# Altium schematic sheet Insole_MCU.SchDoc
size 420 x 297 mm; SheetNumber: 1; SheetTotal: 1
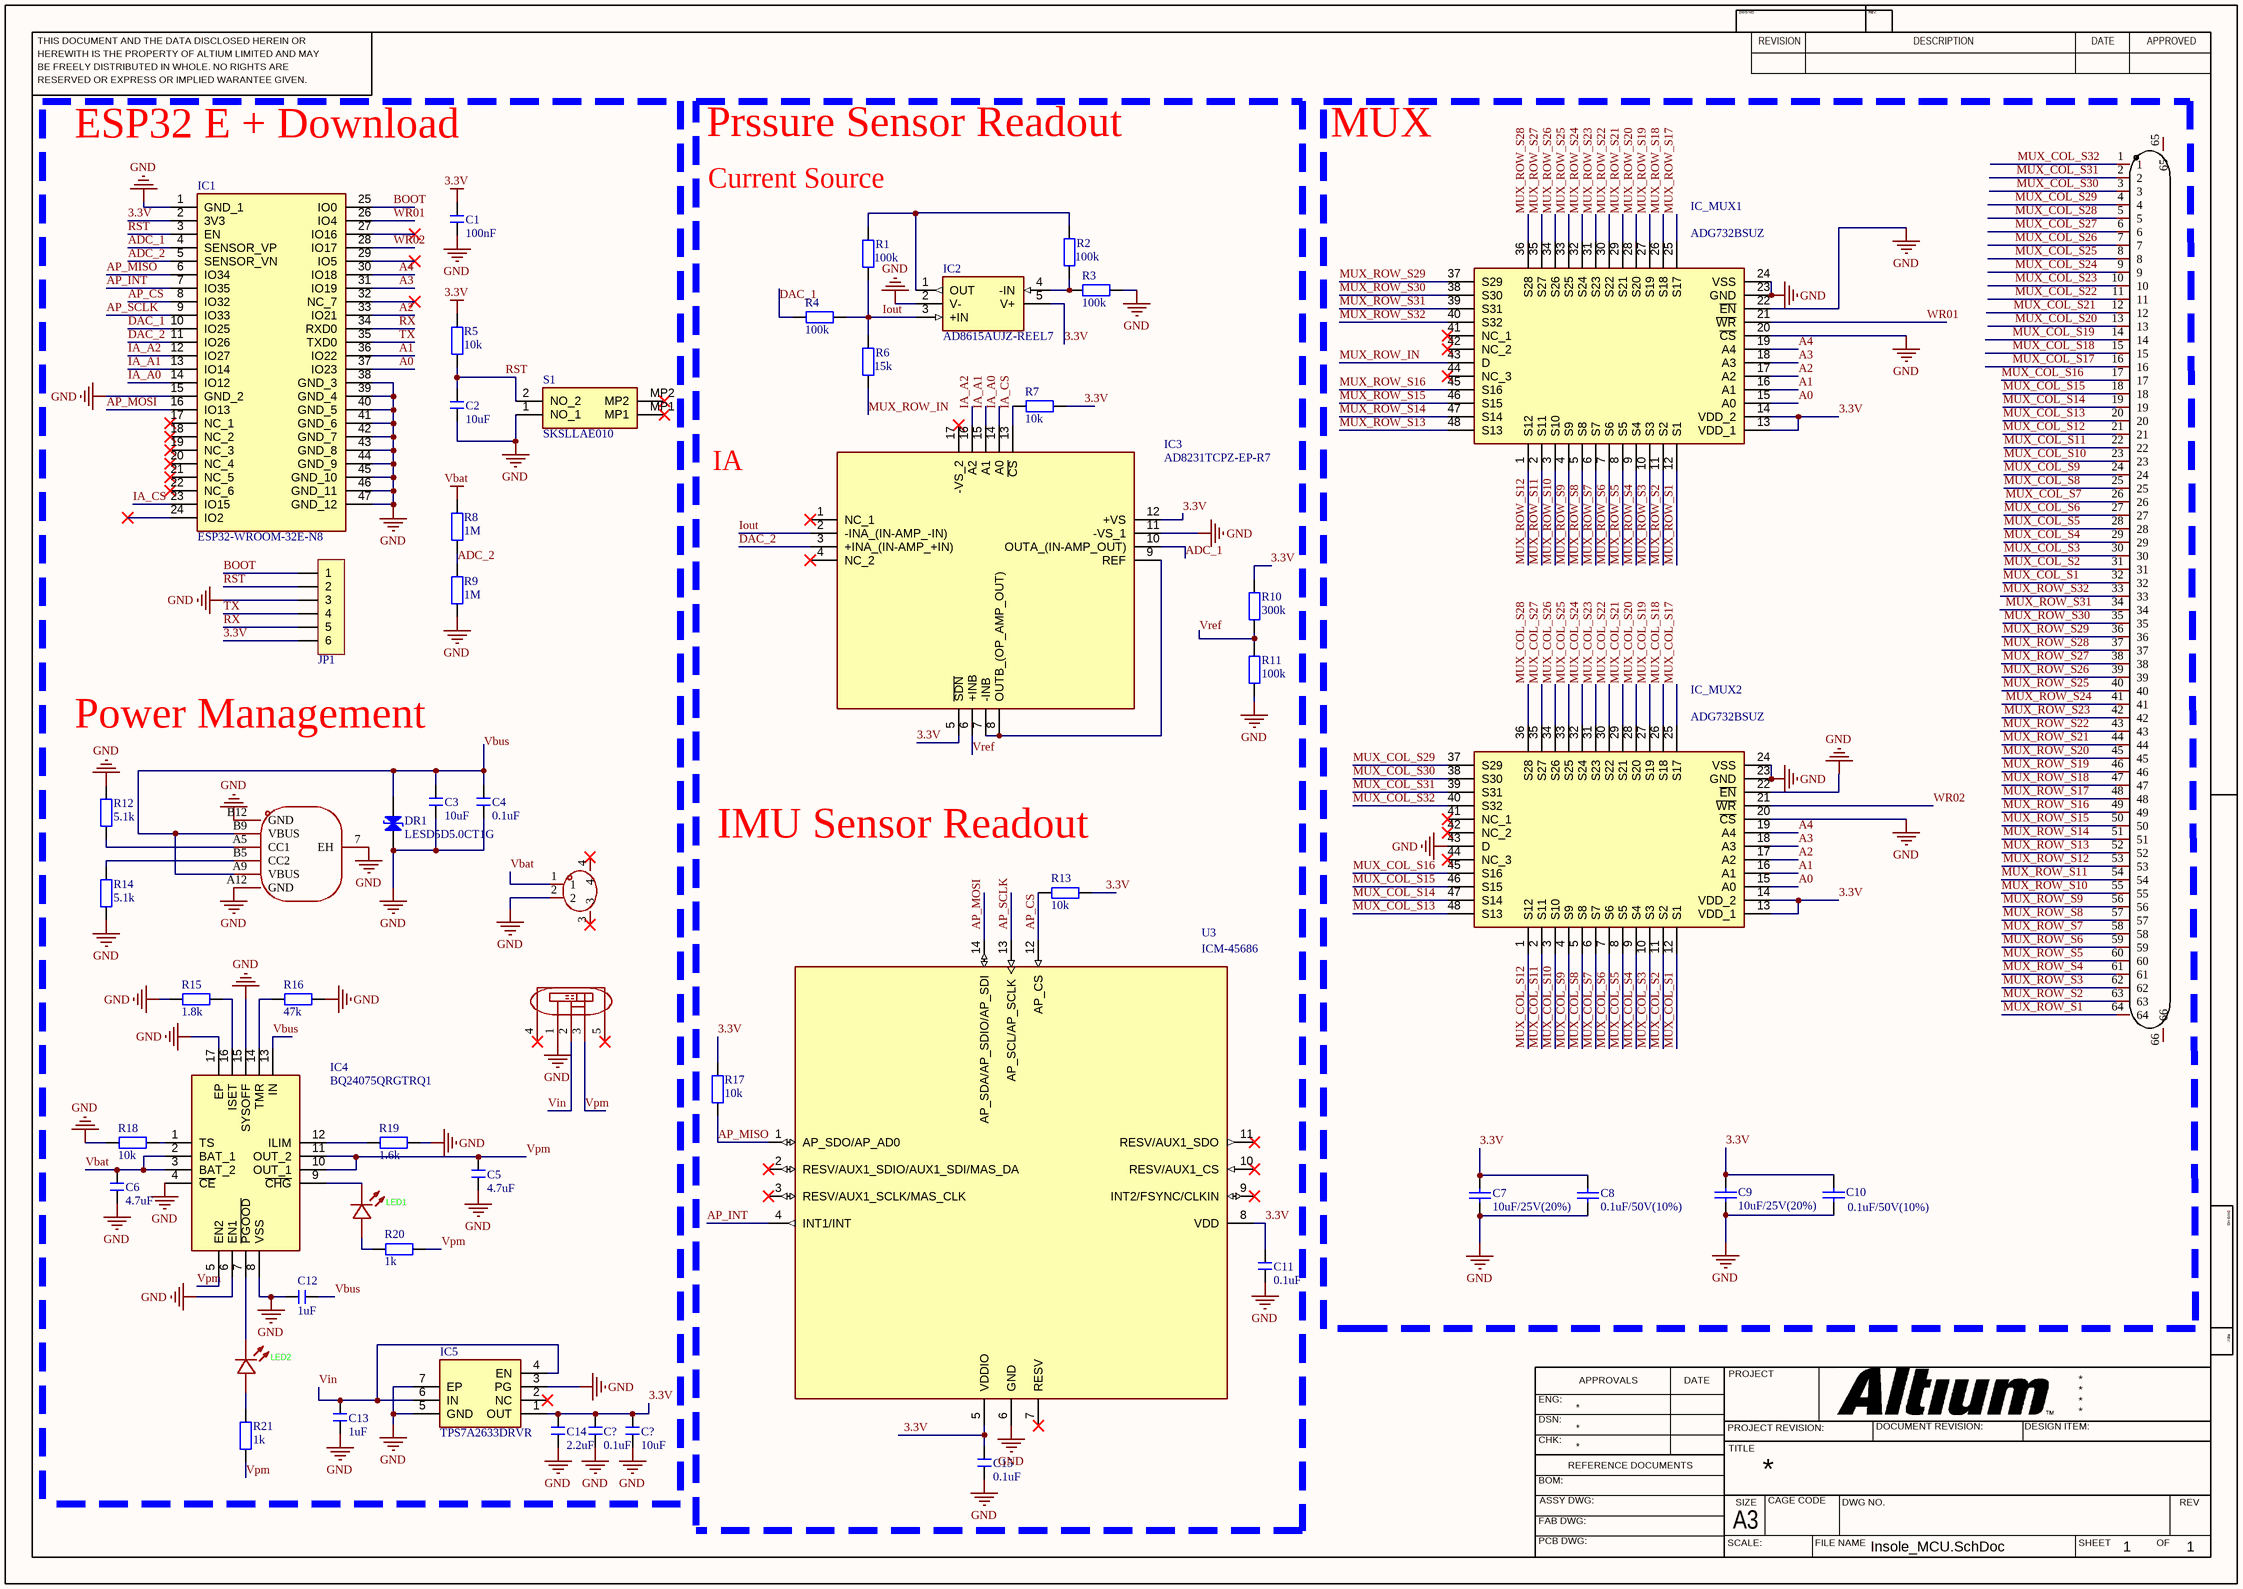
[diagram p0: Insole_MCU.SchDoc]

## Parts
(Parts that share a designator on the sheet are numbered #1, #2 ... from top to bottom, then left to right.)
C1  100nF  [C0402_L]
C2  10uF  [C0402_L]
C3  10uF  [C0402_L]
C4  0.1uF  [C0402_L]
C5  4.7uF  [C0402_L]
C6  4.7uF  [C0402_L]
C7  10uF/25V(20%)  [C0402_L]
C8  0.1uF/50V(10%)  [C0402_L]
C9  10uF/25V(20%)  [C0402_L]
C10  0.1uF/50V(10%)  [C0402_L]
C11  0.1uF  [C0402_L]
C12  1uF  [C0402_L]
C13  1uF  [C0402_L]
C14  2.2uF  [C0402_L]
C15  0.1uF  [C0402_L]
C?#1  0.1uF  [C0402_L]
C?#2  10uF  [C0402_L]
DR1  LESD5D5.0CT1G  [SOD-523]
FPC1  8.15A0.064200  [PCBComponent_1]  (value not drawn)
IC1  ESP32-WROOM-32E-N8  [ESP32WROOM32EN8]
IC2  AD8615AUJZ-REEL7  [SOT95P280X100-5N]
IC3  AD8231TCPZ-EP-R7  [QFN65P400X400X80-17N-D]
IC4  BQ24075QRGTRQ1  [QFN50P300X300X100-17N-D]
IC5  TPS7A2633DRVR  [TPS7A2633DRVR]
IC_MUX1  ADG732BSUZ  [QFP50P900X900X120-48N]
IC_MUX2  ADG732BSUZ  [QFP50P900X900X120-48N]
JP1  HDR-1X6  [HDR2.0-M-LI-6P]  (value not drawn)
LED1  NCD0402R1  [PCBComponent_1]  (value not drawn)
LED2  NCD0402W1  [PCBComponent_1]  (value not drawn)
R1  100k  [R0402_L]
R2  100k  [R0402_L]
R3  100k  [R0402_L]
R4  100k  [R0402_L]
R5  10k  [R0402_L]
R6  15k  [R0402_L]
R7  10k  [R0402_L]
R8  1M  [R0402_L]
R9  1M  [R0402_L]
R10  300k  [R0603_L]
R11  100k  [R0603_L]
R12  5.1k  [R0402_L]
R13  10k  [R0402_L]
R14  5.1k  [R0402_L]
R15  1.8k  [R0402_L]
R16  47k  [R0402_L]
R17  10k  [R0402_L]
R18  10k  [R0402_L]
R19  1.6k  [R0402_L]
R20  1k  [R0402_L]
R21  1k  [R0402_L]
S1  SKSLLAE010  [SKSLLAE010]
SW1  SSSF111800  [SSSF111800]  (value not drawn)
U1  ZX-PH2.0-WT2P  [PCBComponent_1]  (value not drawn)
U2  TYPEC-250Y-BRP6L68  [PCBComponent_1]  (value not drawn)
U3  ICM-45686  [IC_ICM-45686]

## Blocks framed on the sheet
MUX: C7-C10 FPC1 IC_MUX1 IC_MUX2

## Nets
3.3V: C1.1 C7.2 C8.2 C9.2 C10.2 C11.1 C14.1 C15.1 C?#1.1 C?#2.1 IC1.2(3V3) IC2.5(V+) IC3.5(~{SDN}) IC3.12(+VS) IC5.1(OUT) IC_MUX1.13(VDD_1) IC_MUX1.14(VDD_2) IC_MUX2.13(VDD_1) IC_MUX2.14(VDD_2) JP1.6 R5.1 R7.1 R10.1 R13.1 R17.1 U3.5(VDDIO) U3.8(VDD)
GND: C1.2 C2.2 C3.2 C4.2 C5.2 C6.2 C7.1 C8.1 C9.1 C10.1 C11.2 C12.2 C13.2 C14.2 C15.2 C?#1.2 C?#2.2 DR1.2(K) IC1.1(GND_1) IC1.15(GND_2) IC1.38(GND_3) IC1.39(GND_4) IC1.40(GND_5) IC1.41(GND_6) IC1.42(GND_7) IC1.43(GND_8) IC1.44(GND_9) IC1.45(GND_10) IC1.46(GND_11) IC1.47(GND_12) IC2.2(V-) IC3.11(-VS_1) IC4.4(~{CE}) IC4.6(EN1) IC4.8(VSS) IC4.15(SYSOFF) IC4.17(EP) IC5.3(PG) IC5.5(GND) IC5.7(EP) IC_MUX1.20(~{CS}) IC_MUX1.22(~{EN}) IC_MUX1.23(GND) IC_MUX1.24(VSS) IC_MUX2.20(~{CS}) IC_MUX2.22(~{EN}) IC_MUX2.23(GND) IC_MUX2.24(VSS) IC_MUX2.43(D) JP1.3 R3.1 R9.2 R11.2 R12.2 R14.1 R15.1 R16.1 R18.2 R19.2 S1.1(NO_1) SW1.1 U1.2 U2.7(EH) U2.A12(GND) U2.B12(GND) U3.6(GND)
Vbat: C6.1 IC4.2(BAT_1) IC4.3(BAT_2) R8.1 U1.1
A0: IC1.37(IO23) IC_MUX1.15(A0) IC_MUX2.15(A0)
A1: IC1.36(IO22) IC_MUX1.16(A1) IC_MUX2.16(A1)
A2: IC1.33(IO21) IC_MUX1.17(A2) IC_MUX2.17(A2)
A3: IC1.31(IO19) IC_MUX1.18(A3) IC_MUX2.18(A3)
A4: IC1.30(IO18) IC_MUX1.19(A4) IC_MUX2.19(A4)
ADC_1: IC1.4(SENSOR_VP) IC3.10(OUTA_(IN-AMP_OUT))
ADC_2: IC1.5(SENSOR_VN) R8.2 R9.1
AP_CS: IC1.8(IO32) R13.2 U3.12(AP_CS)
AP_INT: IC1.7(IO35) U3.4(INT1/INT)
AP_MISO: IC1.6(IO34) R17.2 U3.1(AP_SDO/AP_AD0)
AP_MOSI: IC1.16(IO13) U3.14(AP_SDA/AP_SDIO/AP_SDI)
AP_SCLK: IC1.9(IO33) U3.13(AP_SCL/AP_SCLK)
BOOT: IC1.25(IO0) JP1.1
DAC_1: IC1.10(IO25) R4.2
DAC_2: IC1.11(IO26) IC3.3(+INA_(IN-AMP_+IN))
IA_A0: IC1.14(IO12) IC3.14(A0)
IA_A1: IC1.13(IO14) IC3.15(A1)
IA_A2: IC1.12(IO27) IC3.16(A2)
IA_CS: IC1.23(IO15) IC3.13(~{CS}) R7.2
Iout: IC2.3(+IN) IC3.2(-INA_(IN-AMP_-IN)) R1.1 R4.1 R6.2
MUX_COL_S1: FPC1.32 IC_MUX2.12(S1)
MUX_COL_S2: FPC1.31 IC_MUX2.11(S2)
MUX_COL_S3: FPC1.30 IC_MUX2.10(S3)
MUX_COL_S4: FPC1.29 IC_MUX2.9(S4)
MUX_COL_S5: FPC1.28 IC_MUX2.8(S5)
MUX_COL_S6: FPC1.27 IC_MUX2.7(S6)
MUX_COL_S7: FPC1.26 IC_MUX2.6(S7)
MUX_COL_S8: FPC1.25 IC_MUX2.5(S8)
MUX_COL_S9: FPC1.24 IC_MUX2.4(S9)
MUX_COL_S10: FPC1.23 IC_MUX2.3(S10)
MUX_COL_S11: FPC1.22 IC_MUX2.2(S11)
MUX_COL_S12: FPC1.21 IC_MUX2.1(S12)
MUX_COL_S13: FPC1.20 IC_MUX2.48(S13)
MUX_COL_S14: FPC1.19 IC_MUX2.47(S14)
MUX_COL_S15: FPC1.18 IC_MUX2.46(S15)
MUX_COL_S16: FPC1.17 IC_MUX2.45(S16)
MUX_COL_S17: FPC1.16 IC_MUX2.25(S17)
MUX_COL_S18: FPC1.15 IC_MUX2.26(S18)
MUX_COL_S19: FPC1.14 IC_MUX2.27(S19)
MUX_COL_S20: FPC1.13 IC_MUX2.28(S20)
MUX_COL_S21: FPC1.12 IC_MUX2.29(S21)
MUX_COL_S22: FPC1.11 IC_MUX2.30(S22)
MUX_COL_S23: FPC1.10 IC_MUX2.31(S23)
MUX_COL_S24: FPC1.9 IC_MUX2.32(S24)
MUX_COL_S25: FPC1.8 IC_MUX2.33(S25)
MUX_COL_S26: FPC1.7 IC_MUX2.34(S26)
MUX_COL_S27: FPC1.6 IC_MUX2.35(S27)
MUX_COL_S28: FPC1.5 IC_MUX2.36(S28)
MUX_COL_S29: FPC1.4 IC_MUX2.37(S29)
MUX_COL_S30: FPC1.3 IC_MUX2.38(S30)
MUX_COL_S31: FPC1.2 IC_MUX2.39(S31)
MUX_COL_S32: FPC1.1 IC_MUX2.40(S32)
MUX_ROW_IN: IC_MUX1.43(D) R6.1
MUX_ROW_S1: FPC1.64 IC_MUX1.12(S1)
MUX_ROW_S2: FPC1.63 IC_MUX1.11(S2)
MUX_ROW_S3: FPC1.62 IC_MUX1.10(S3)
MUX_ROW_S4: FPC1.61 IC_MUX1.9(S4)
MUX_ROW_S5: FPC1.60 IC_MUX1.8(S5)
MUX_ROW_S6: FPC1.59 IC_MUX1.7(S6)
MUX_ROW_S7: FPC1.58 IC_MUX1.6(S7)
MUX_ROW_S8: FPC1.57 IC_MUX1.5(S8)
MUX_ROW_S9: FPC1.56 IC_MUX1.4(S9)
MUX_ROW_S10: FPC1.55 IC_MUX1.3(S10)
MUX_ROW_S11: FPC1.54 IC_MUX1.2(S11)
MUX_ROW_S12: FPC1.53 IC_MUX1.1(S12)
MUX_ROW_S13: FPC1.52 IC_MUX1.48(S13)
MUX_ROW_S14: FPC1.51 IC_MUX1.47(S14)
MUX_ROW_S15: FPC1.50 IC_MUX1.46(S15)
MUX_ROW_S16: FPC1.49 IC_MUX1.45(S16)
MUX_ROW_S17: FPC1.48 IC_MUX1.25(S17)
MUX_ROW_S18: FPC1.47 IC_MUX1.26(S18)
MUX_ROW_S19: FPC1.46 IC_MUX1.27(S19)
MUX_ROW_S20: FPC1.45 IC_MUX1.28(S20)
MUX_ROW_S21: FPC1.44 IC_MUX1.29(S21)
MUX_ROW_S22: FPC1.43 IC_MUX1.30(S22)
MUX_ROW_S23: FPC1.42 IC_MUX1.31(S23)
MUX_ROW_S24: FPC1.41 IC_MUX1.32(S24)
MUX_ROW_S25: FPC1.40 IC_MUX1.33(S25)
MUX_ROW_S26: FPC1.39 IC_MUX1.34(S26)
MUX_ROW_S27: FPC1.38 IC_MUX1.35(S27)
MUX_ROW_S28: FPC1.37 IC_MUX1.36(S28)
MUX_ROW_S29: FPC1.36 IC_MUX1.37(S29)
MUX_ROW_S30: FPC1.35 IC_MUX1.38(S30)
MUX_ROW_S31: FPC1.34 IC_MUX1.39(S31)
MUX_ROW_S32: FPC1.33 IC_MUX1.40(S32)
RST: C2.1 IC1.3(EN) JP1.2 R5.2 S1.2(NO_2)
RX: IC1.34(RXD0) JP1.5
TX: IC1.35(TXD0) JP1.4
Vbus: C3.1 C4.1 C12.1 DR1.1(A) IC4.13(IN) U2.A9(VBUS) U2.B9(VBUS)
Vin: C13.1 IC5.4(EN) IC5.6(IN) SW1.2
Vpm: C5.1 IC4.5(EN2) IC4.10(OUT_1) IC4.11(OUT_2) R20.1 R21.1 SW1.3
Vref: IC3.6(+INB) R10.2 R11.1
WR01: IC1.26(IO4) IC_MUX1.21(~{WR})
WR02: IC1.28(IO17) IC_MUX2.21(~{WR})
NetIC2_1: IC2.1(OUT) R1.2 R2.2
NetIC2_4: IC2.4(-IN) R2.1 R3.2
NetIC3_7: IC3.7(-INB) IC3.8(OUTB_(OP_AMP_OUT)) IC3.9(REF)
NetIC4_1: IC4.1(TS) R18.1
NetIC4_7: IC4.7(~{PGOOD}) LED2.1(K)
NetIC4_9: IC4.9(~{CHG}) LED1.1(K)
NetIC4_12: IC4.12(ILIM) R19.1
NetIC4_14: IC4.14(TMR) R16.2
NetIC4_16: IC4.16(ISET) R15.2
NetLED1_2: LED1.2(A) R20.2
NetLED2_2: LED2.2(A) R21.2
NetR12_1: R12.1 U2.A5(CC1)
NetR14_2: R14.2 U2.B5(CC2)

Not connected (* = marked no-connect by the designer): FPC1 65 66; IC1 17(NC_1)* 18(NC_2)* 19(NC_3)* 20(NC_4)* 21(NC_5)* 22(NC_6)* 24(IO2)* 27(IO16)* 29(IO5)* 32(NC_7)*; IC3 1(NC_1)* 4(NC_2)* 17(-VS_2)*; IC5 2(NC)*; IC_MUX1 41(NC_1)* 42(NC_2)* 44(NC_3)*; IC_MUX2 41(NC_1)* 42(NC_2)* 44(NC_3)*; S1 MP1* MP2*; SW1 4* 5*; U1 3* 4*; U3 2(RESV/AUX1_SDIO/AUX1_SDI/MAS_DA)* 3(RESV/AUX1_SCLK/MAS_CLK)* 7(RESV)* 9(INT2/FSYNC/CLKIN)* 10(RESV/AUX1_CS)* 11(RESV/AUX1_SDO)*

## Notes on the sheet
- ESP32 E + Download
- Prssure Sensor Readout
- (near R1) Current Source
- IA
- Power Management
- (near R13) IMU Sensor Readout
- THIS DOCUMENT AND THE DATA DISCLOSED HEREIN OR
- HEREWITH IS THE PROPERTY OF ALTIUM LIMITED AND MAY
- DWG NO:
- REVISION
- REV:
- DESCRIPTION
- DATE
- APPROVED
- BE FREELY DISTRIBUTED IN WHOLE. NO RIGHTS ARE
- RESERVED OR EXPRESS OR IMPLIED WARANTEE GIVEN.
- ENG:
- APPROVALS
- PROJECT
- DSN:
- CHK:
- REFERENCE DOCUMENTS
- PROJECT REVISION:
- TITLE
- DOCUMENT REVISION:
- DESIGN ITEM:
- BOM:
- FAB DWG:
- PCB DWG:
- ASSY DWG:
- SCALE:
- A3
- SIZE
- CAGE CODE
- FILE NAME
- DWG NO.
- SHEET
- OF
- REV

## Library data of the parts
C1-C6 C11-C15 C?#1 C?#2 = C: 贴片电容; BOM名称: 无极性贴片电容; 淘宝ID: 封装库来自淘宝 ID：黄晶宝石; 联系售后，技术支持: https://shop463601444.taobao.com; 唯一出售店铺网址: https://shop463601444.taobao.com
C7-C10 = C: 贴片电容/MLCC电容; BOM名称: 无极性贴片电容; 联系下单店铺卖家 免费帮你查找封装: 联系下单店铺卖家 免费技术指导; 当前库版本V2024.2.3 @淘宝卖家:黄晶宝石: 最新版本发布https://item.taobao.com/item.htm?id=566775463719
DR1 = DR: 瞬态电压抑制二极管 1负极; 版权归属: 封装库来自淘宝 ID：黄晶宝石; BOM名称: 瞬态电压抑制二极管; 学习资源: https://item.taobao.com/item.htm?id=566775463719
FPC1 = 8.15A0.064200: Manufacturer: DIANWEI(钿威科技); Add into BOM: yes; Locking Feature: Clamshell; Number of Contacts: 64P; Pitch: 0.5mm; Symbol: 8.15A0.064200; Device: 8.15A0.064200; LCSC Part Name: 翻盖式 下接 P数:64P 间距:0.5mm; Supplier Part: C20626047; Manufacturer Part: 8.15A0.064200; Supplier Footprint: SMD,P=0.5mm,卧贴; JLCPCB Part Class: Extended Part; Datasheet: https://atta.szlcsc.com/upload/public/pdf/source/20240226/9B0E964ABAD9EBDCC7FF6472C3CD9B36.pdf; Supplier: LCSC; Convert to PCB: yes; Contact Type: Bottom Contact; Height Above Board: 1.8mm; Contact Plating: Gold
IC1 = ESP32-WROOM-32E-N8: Integrated Circuit; Manufacturer_Name: Espressif Systems; Datasheet Link: https://www.google.com/url?sa=t&rct=j&q=&esrc=s&source=web&cd=&ved=2ahUKEwjLw4ysybv2AhXFzIUKHZUbB64QFnoECCwQAQ&url=https%3A%2F%2Fwww.espressif.com%2Fsites%2Fdefault%2Ffiles%2Fdocumentation%2Fesp32-wroom-32e_esp32-wroom-32ue_datasheet_en.pdf&usg=AOvVaw1xSL; Height: 3.25mm; Manufacturer_Part_Number: ESP32-WROOM-32E-N8; Mouser Part Number: 356-ESP32WRM32E164PH; Mouser Price/Stock: https://www.mouser.co.uk/ProductDetail/Espressif-Systems/ESP32-WROOM-32E-N8?qs=Li%252BoUPsLEnsLnZW%252BGLgUhw%3D%3D
IC2 = AD8615AUJZ-REEL7: Integrated Circuit; Manufacturer_Name: Analog Devices; Datasheet Link: http://www.farnell.com/datasheets/1841629.pdf; Height: 1mm; Manufacturer_Part_Number: AD8615AUJZ-REEL7; Mouser Part Number: 584-AD8615AUJZ-R7; Mouser Price/Stock: https://www.mouser.co.uk/ProductDetail/Analog-Devices/AD8615AUJZ-REEL7?qs=%2FtpEQrCGXCyHRrprFEn%2Fog%3D%3D; Arrow Part Number: AD8615AUJZ-REEL7; Arrow Price/Stock: https://www.arrow.com/en/products/ad8615aujz-reel7/analog-devices?utm_currency=USD&region=europe
IC3 = AD8231TCPZ-EP-R7: Integrated Circuit; Manufacturer_Name: Analog Devices; Datasheet Link: https://www.analog.com/media/en/technical-documentation/data-sheets/AD8231-EP.pdf; Height: 0.8mm; Manufacturer_Part_Number: AD8231TCPZ-EP-R7; Mouser Part Number: 584-AD8231TCPZ-EP-R7; Mouser Price/Stock: https://www.mouser.co.uk/ProductDetail/Analog-Devices/AD8231TCPZ-EP-R7?qs=%2FtpEQrCGXCwVvPTzyZftPQ%3D%3D; Arrow Part Number: AD8231TCPZ-EP-R7; Arrow Price/Stock: https://www.arrow.com/en/products/ad8231tcpz-ep-r7/analog-devices?region=nac
IC4 = BQ24075QRGTRQ1: Integrated Circuit; Manufacturer_Name: Texas Instruments; Datasheet Link: http://www.ti.com/lit/gpn/bq24075-q1; Height: 1mm; Manufacturer_Part_Number: BQ24075QRGTRQ1; Mouser Part Number: 595-BQ24075QRGTRQ1; Mouser Price/Stock: https://www.mouser.co.uk/ProductDetail/Texas-Instruments/BQ24075QRGTRQ1?qs=i8JZjLRTtkLLeOPMlhTMpg%3D%3D; Arrow Part Number: BQ24075QRGTRQ1; Arrow Price/Stock: null?region=nac
IC5 = TPS7A2633DRVR: Integrated Circuit; Manufacturer_Name: Texas Instruments; Datasheet Link: https://www.ti.com/lit/gpn/TPS7A26; Height: 0.8mm; Manufacturer_Part_Number: TPS7A2633DRVR; Mouser Part Number: 595-TPS7A2633DRVR; Mouser Price/Stock: https://www.mouser.co.uk/ProductDetail/Texas-Instruments/TPS7A2633DRVR?qs=OTrKUuiFdkZcobdYhR7qbQ%3D%3D; Arrow Part Number: TPS7A2633DRVR; Arrow Price/Stock: null?utm_currency=USD&region=nac
IC_MUX1 IC_MUX2 = ADG732BSUZ: Integrated Circuit; Manufacturer_Name: Analog Devices; Datasheet Link: https://datasheet.datasheetarchive.com/originals/distributors/Datasheets-4/DSA-69835.pdf; Height: 1.2mm; Manufacturer_Part_Number: ADG732BSUZ; Mouser Part Number: 584-ADG732BSUZ; Mouser Price/Stock: https://www.mouser.co.uk/ProductDetail/Analog-Devices/ADG732BSUZ?qs=BpaRKvA4VqFZhnJK9M1XMA%3D%3D; Arrow Part Number: ADG732BSUZ; Arrow Price/Stock: https://www.arrow.com/en/products/adg732bsuz/analog-devices?region=europe
JP1 = Header 6: 6P接插件; 封装库来自淘宝卖家 ID：黄晶宝石: 最新版本发布https://item.taobao.com/item.htm?id=566775463719
LED1 = NCD0402R1: Manufacturer: 国星光电; Symbol: FC-F1005HRK-620H5; Add into BOM: yes; Emitted Color: Red; Forward Voltage (VF): 1.6V~2.6V; Power Dissipation: 65mW; Forward Current: 5mA; Dominant Wavelength: 615nm~635nm; Lens Color: 无色透明透镜; Luminous Intensity: 13mcd~30mcd; Viewing Angle: 130°; Device: NCD0402R1; LCSC Part Name: NCD0402R1; Supplier Part: C130719; Manufacturer Part: NCD0402R1; Supplier Footprint: 0402; JLCPCB Part Class: Extended Part; Datasheet: https://atta.szlcsc.com/upload/public/pdf/source/20200820/C130719_A72EA5A7FEC83C35856EA0453E4EE775.pdf; Supplier: LCSC; Convert to PCB: yes; Operating Temperature: -30℃~+85℃
LED2 = NCD0402R1: white led 0402; Manufacturer: 国星光电; Symbol: FC-F1005HRK-620H5; Add into BOM: yes; Emitted Color: Red; Forward Voltage (VF): 1.6V~2.6V; Power Dissipation: 65mW; Forward Current: 5mA; Dominant Wavelength: 615nm~635nm; Lens Color: 无色透明透镜; Luminous Intensity: 13mcd~30mcd; Viewing Angle: 130°; Device: NCD0402R1; LCSC Part Name: NCD0402R1; Supplier Part: C130719; Manufacturer Part: NCD0402R1; Supplier Footprint: 0402; JLCPCB Part Class: Extended Part; Datasheet: https://atta.szlcsc.com/upload/public/pdf/source/20200820/C130719_A72EA5A7FEC83C35856EA0453E4EE775.pdf; Supplier: LCSC; Convert to PCB: yes; Operating Temperature: -30℃~+85℃
R1-R21 = R: 贴片电阻; 联系下单店铺卖家 免费帮你查找封装: 联系下单店铺卖家 免费技术指导; BOM名称: 贴片电阻
S1 = SKSLLAE010: Switch; Manufacturer_Name: ALPS Electric; Datasheet Link: https://tech.alpsalpine.com/prod/e/html/tact/surfacemount/sksl/sksllae010.html; Height: 2.2mm; Manufacturer_Part_Number: SKSLLAE010; Mouser Part Number: 688-SKSLLAE010; Mouser Price/Stock: https://www.mouser.co.uk/ProductDetail/Alps-Alpine/SKSLLAE010?qs=9kmVzdp4bk0xNY%252Br3ZkAyw%3D%3D; Arrow Part Number: SKSLLAE010; Arrow Price/Stock: https://www.arrow.com/en/products/sksllae010/alps-electric
SW1 = SSSF111800: slide switch; Manufacturer: ALPSALPINE(阿尔卑斯阿尔派); Add into BOM: yes; Circuit: SPDT; Actuator Style: Rectangular columnar; Pin Style: PCPin; Switch Height: 14mm; Current Rating (DC): 100mA; Voltage Rating (DC): 30V; Mechanical Life: 1万次; Symbol: SSSF111800; Device: SSSF111800; LCSC Part Name: SSSF111800; Supplier Part: C97450; Manufacturer Part: SSSF111800; Supplier Footprint: 插件; JLCPCB Part Class: Extended Part; Datasheet: https://atta.szlcsc.com/upload/public/pdf/source/20170325/1490427937134.pdf; Supplier: LCSC; Convert to PCB: yes; Mounting Style: 侧插; Current Rating (AC): -; Voltage Rating (AC): -; Operating Temperature: -10℃~+60℃
U1 = ZX-PH2.0-WT2P: Manufacturer: Megastar(兆星); Add into BOM: yes; Pins Structure: 1x2P; Pitch: 2mm; Reference Series: PH; Number of PINs Per Row: 2; Supplementary Features: Auxiliary soldering legs; Z-Height of the Board: 5.6mm; X-Length of Bottom Edge on Board (Spacing Line): 8mm; Y-Width of Bottom Edge on Board: 8.5mm; Symbol: ZX-PH2.0-WT2P; Device: ZX-PH2.0-WT2P; LCSC Part Name: 1x2P 间距:2mm 卧贴 系列:PH 配套胶壳型号：ZX-PH2.0-2PJK 配套端子型号：ZX-PH2.0-DZ 配套杜邦线型号：ZX-PH2.0-2PBXC; Supplier Part: C7429689; Manufacturer Part: ZX-PH2.0-WT2P; Supplier Footprint: SMD,P=2mm,卧贴; JLCPCB Part Class: Extended Part; Datasheet: https://atta.szlcsc.com/upload/public/pdf/source/20230619/22F856A07318150DB50BEAE33DC9B491.pdf; Supplier: LCSC; Convert to PCB: yes; Mounting Style: Horizontal attachment; Number of Pins: 2P; Number of Rows: 1; Row Spacing: -; Current Rating (Max): -; Contact Material: Brass; Contact Plating: Tin; Operating Temperature Range: -; Rated Voltage (Max): -; Plastic Material: -; Flame Retardant Rating: -; Colour: Beige
U2 = TYPEC-250Y-BRP6L68: Manufacturer: XUNPU(讯普); Add into BOM: yes; Connector Type: Type-C; Gender: Female; Symbol: TYPEC-250Y-BRP6L68; Device: TYPEC-250Y-BRP6L68; LCSC Part Name: Type-C 母; Supplier Part: C5252714; Manufacturer Part: TYPEC-250Y-BRP6L68; Supplier Footprint: SMD; JLCPCB Part Class: Extended Part; Datasheet: https://atta.szlcsc.com/upload/public/pdf/source/20221110/D866B449E7E05D725FFD0DA4DBD418D3.pdf; Supplier: LCSC; Convert to PCB: yes
U3 = CMP-003-000000-1: Accelerometer, Gyroscope, 6 Axis Sensor I2C, I3C, SPI Output; MF: TDK InvenSense; MP: ICM-45686; Check_prices: https://www.snapeda.com/parts/ICM-45686/TDK+InvenSense/view-part/?ref=eda; Pin Count: 14; Component Type: Standard; Value: *; Package: Package; SnapEDA_Link: https://www.snapeda.com/parts/ICM-45686/TDK+InvenSense/view-part/?ref=snap; Source: ICM-45686.SchLib; Design Item ID: ICM-45686